# Altium schematic sheet HPC_AB.SchDoc: HPC connector ROW A and ROW B
size A4; Date: 20.05.2022; ApprovedBy: PFH; CompanyName: IAM Electronic GmbH; DrawnBy: PFH; Engineer: PFH; Revision: A; SheetNumber: 2; SheetTotal: 6; Projekt: FMC Power Module; Website: www.iamelectronic.com
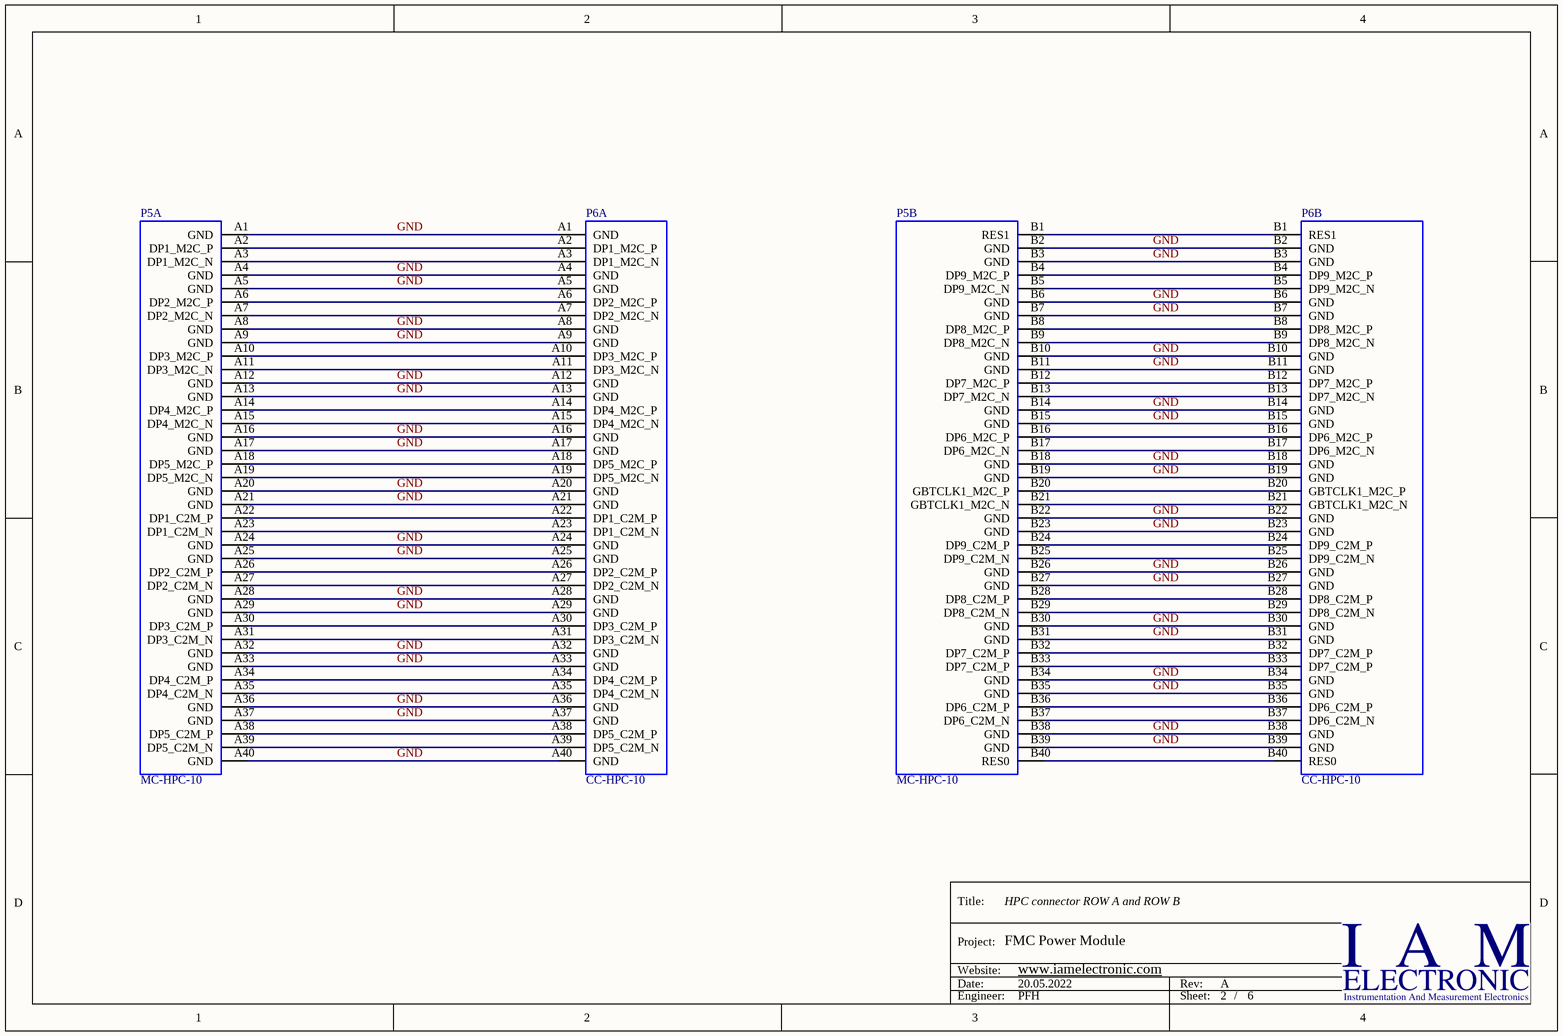
[diagram p0: HPC_AB.SchDoc]

## Parts
P5  MC-HPC-10  [ASP-134488-01]  (parts A,B of 10)
P6  CC-HPC-10  [ASP-134486-01]  (parts A,B of 10)

## Nets
GND: P5.A1(GND) P5.A4(GND) P5.A5(GND) P5.A8(GND) P5.A9(GND) P5.A12(GND) P5.A13(GND) P5.A16(GND) P5.A17(GND) P5.A20(GND) P5.A21(GND) P5.A24(GND) P5.A25(GND) P5.A28(GND) P5.A29(GND) P5.A32(GND) P5.A33(GND) P5.A36(GND) P5.A37(GND) P5.A40(GND) P5.B2(GND) P5.B3(GND) P5.B6(GND) P5.B7(GND) P5.B10(GND) P5.B11(GND) P5.B14(GND) P5.B15(GND) P5.B18(GND) P5.B19(GND) P5.B22(GND) P5.B23(GND) P5.B26(GND) P5.B27(GND) P5.B30(GND) P5.B31(GND) P5.B34(GND) P5.B35(GND) P5.B38(GND) P5.B39(GND) P6.A1(GND) P6.A4(GND) P6.A5(GND) P6.A8(GND) P6.A9(GND) P6.A12(GND) P6.A13(GND) P6.A16(GND) P6.A17(GND) P6.A20(GND) P6.A21(GND) P6.A24(GND) P6.A25(GND) P6.A28(GND) P6.A29(GND) P6.A32(GND) P6.A33(GND) P6.A36(GND) P6.A37(GND) P6.A40(GND) P6.B2(GND) P6.B3(GND) P6.B6(GND) P6.B7(GND) P6.B10(GND) P6.B11(GND) P6.B14(GND) P6.B15(GND) P6.B18(GND) P6.B19(GND) P6.B22(GND) P6.B23(GND) P6.B26(GND) P6.B27(GND) P6.B30(GND) P6.B31(GND) P6.B34(GND) P6.B35(GND) P6.B38(GND) P6.B39(GND)
NetP5_A2: P5.A2(DP1_M2C_P) P6.A2(DP1_M2C_P)
NetP5_A3: P5.A3(DP1_M2C_N) P6.A3(DP1_M2C_N)
NetP5_A6: P5.A6(DP2_M2C_P) P6.A6(DP2_M2C_P)
NetP5_A7: P5.A7(DP2_M2C_N) P6.A7(DP2_M2C_N)
NetP5_A10: P5.A10(DP3_M2C_P) P6.A10(DP3_M2C_P)
NetP5_A11: P5.A11(DP3_M2C_N) P6.A11(DP3_M2C_N)
NetP5_A14: P5.A14(DP4_M2C_P) P6.A14(DP4_M2C_P)
NetP5_A15: P5.A15(DP4_M2C_N) P6.A15(DP4_M2C_N)
NetP5_A18: P5.A18(DP5_M2C_P) P6.A18(DP5_M2C_P)
NetP5_A19: P5.A19(DP5_M2C_N) P6.A19(DP5_M2C_N)
NetP5_A22: P5.A22(DP1_C2M_P) P6.A22(DP1_C2M_P)
NetP5_A23: P5.A23(DP1_C2M_N) P6.A23(DP1_C2M_N)
NetP5_A26: P5.A26(DP2_C2M_P) P6.A26(DP2_C2M_P)
NetP5_A27: P5.A27(DP2_C2M_N) P6.A27(DP2_C2M_N)
NetP5_A30: P5.A30(DP3_C2M_P) P6.A30(DP3_C2M_P)
NetP5_A31: P5.A31(DP3_C2M_N) P6.A31(DP3_C2M_N)
NetP5_A34: P5.A34(DP4_C2M_P) P6.A34(DP4_C2M_P)
NetP5_A35: P5.A35(DP4_C2M_N) P6.A35(DP4_C2M_N)
NetP5_A38: P5.A38(DP5_C2M_P) P6.A38(DP5_C2M_P)
NetP5_A39: P5.A39(DP5_C2M_N) P6.A39(DP5_C2M_N)
NetP5_B1: P5.B1(RES1) P6.B1(RES1)
NetP5_B4: P5.B4(DP9_M2C_P) P6.B4(DP9_M2C_P)
NetP5_B5: P5.B5(DP9_M2C_N) P6.B5(DP9_M2C_N)
NetP5_B8: P5.B8(DP8_M2C_P) P6.B8(DP8_M2C_P)
NetP5_B9: P5.B9(DP8_M2C_N) P6.B9(DP8_M2C_N)
NetP5_B12: P5.B12(DP7_M2C_P) P6.B12(DP7_M2C_P)
NetP5_B13: P5.B13(DP7_M2C_N) P6.B13(DP7_M2C_N)
NetP5_B16: P5.B16(DP6_M2C_P) P6.B16(DP6_M2C_P)
NetP5_B17: P5.B17(DP6_M2C_N) P6.B17(DP6_M2C_N)
NetP5_B20: P5.B20(GBTCLK1_M2C_P) P6.B20(GBTCLK1_M2C_P)
NetP5_B21: P5.B21(GBTCLK1_M2C_N) P6.B21(GBTCLK1_M2C_N)
NetP5_B24: P5.B24(DP9_C2M_P) P6.B24(DP9_C2M_P)
NetP5_B25: P5.B25(DP9_C2M_N) P6.B25(DP9_C2M_N)
NetP5_B28: P5.B28(DP8_C2M_P) P6.B28(DP8_C2M_P)
NetP5_B29: P5.B29(DP8_C2M_N) P6.B29(DP8_C2M_N)
NetP5_B32: P5.B32(DP7_C2M_P) P6.B32(DP7_C2M_P)
NetP5_B33: P5.B33(DP7_C2M_P) P6.B33(DP7_C2M_P)
NetP5_B36: P5.B36(DP6_C2M_P) P6.B36(DP6_C2M_P)
NetP5_B37: P5.B37(DP6_C2M_N) P6.B37(DP6_C2M_N)
NetP5_B40: P5.B40(RES0) P6.B40(RES0)

## Notes on the sheet
- Title:
- Project:
- Date:
- Website:
- Rev:
- Engineer:
- Sheet:
- /

## Library data of the parts
P5 = MC-HPC-10: MC-HPC-10, FMC High-pin count connector, lead free, 400 I/Os, male, 10 mm mated stack height; Manufacturer: Samtec; Manufacturer Ref: SEAM-40-03.5-S-10-2-A-K-TR-VITA57.0; Pitch: 1.27 mm; Mated Stack Height: 10 mm; Solder Type: Lead-Free; Number I/O: 400; PartName: ASP-134488-01; Part: ASP-134488-01; Vita PartNumber: MC-HPC-10; Pin Count: High; Gender: male; Supplier 1: Digi-Key; Supplier Part Number 1: SAM8730-ND
P6 = CC-HPC-10: CC-HPC-10, FMC High-pin count connector, lead free, 400 I/Os, female, 10 mm mated stack height; Manufacturer: Samtec; Manufacturer Ref: SEAF-40-06.5-10-A; Pitch: 1.27 mm; Mated Stack Height: 10 mm; Solder Type: Lead-Free; Number I/O: 400; PartName: ASP-134486-01; Part: ASP-134486-01; Vita PartNumber: CC-HPC-10; Pin Count: High; Gender: female; Supplier 1: Digi-Key; Supplier Part Number 1: SAM8728-ND